# Altium schematic sheet Power.SchDoc
size A3; SheetNumber: 1; SheetTotal: 2
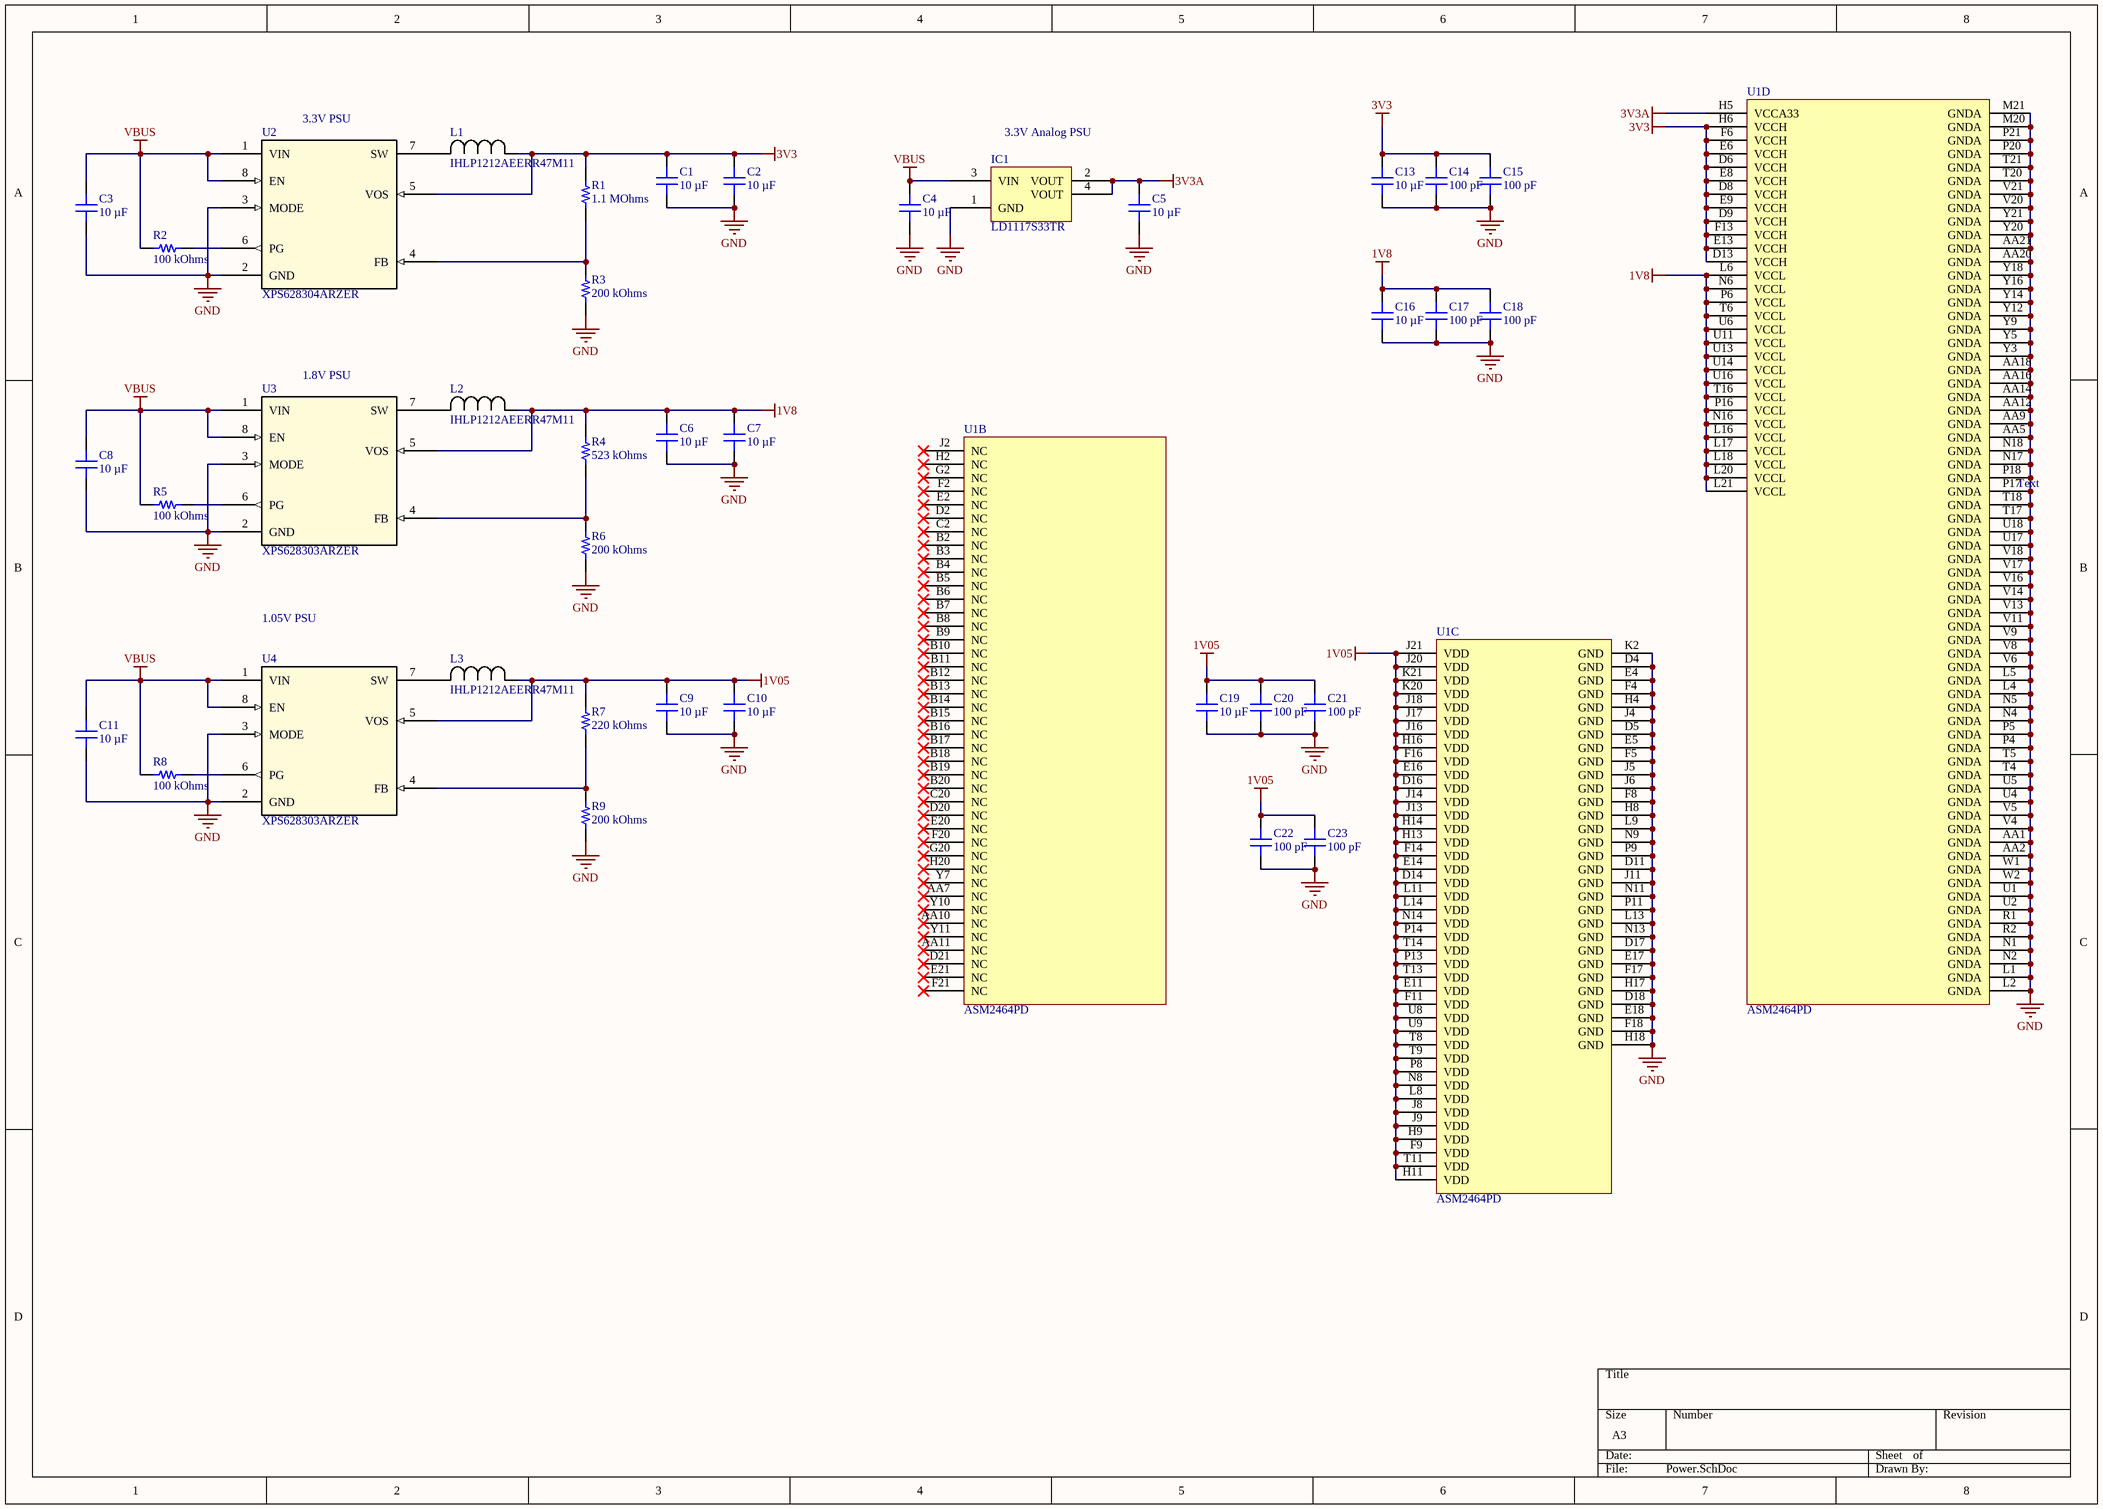
[diagram p0: Power.SchDoc]

## Parts
C1  10 µF  [CAP 0805_2012]
C2  10 µF  [CAP 0805_2012]
C3  10 µF  [CAP 0805_2012]
C4  10 µF  [CAP 0805_2012]
C5  10 µF  [CAP 0805_2012]
C6  10 µF  [CAP 0805_2012]
C7  10 µF  [CAP 0805_2012]
C8  10 µF  [CAP 0805_2012]
C9  10 µF  [CAP 0805_2012]
C10  10 µF  [CAP 0805_2012]
C11  10 µF  [CAP 0805_2012]
C13  10 µF  [CAP 0805_2012]
C14  100 pF  [CAP 0603_1608]
C15  100 pF  [CAP 0603_1608]
C16  10 µF  [CAP 0805_2012]
C17  100 pF  [CAP 0603_1608]
C18  100 pF  [CAP 0603_1608]
C19  10 µF  [CAP 0805_2012]
C20  100 pF  [CAP 0603_1608]
C21  100 pF  [CAP 0603_1608]
C22  100 pF  [CAP 0603_1608]
C23  100 pF  [CAP 0603_1608]
IC1  LD1117S33TR  [ST SOT-223]
L1  IHLP1212AEERR47M11  [IND_IHLP-1212AE_VIS]
L2  IHLP1212AEERR47M11  [IND_IHLP-1212AE_VIS]
L3  IHLP1212AEERR47M11  [IND_IHLP-1212AE_VIS]
R1  1.1 MOhms  [RES 0805_2012]
R2  100 kOhms  [RES 0805_2012]
R3  200 kOhms  [RES 0805_2012]
R4  523 kOhms  [RES 0805_2012]
R5  100 kOhms  [RES 0805_2012]
R6  200 kOhms  [RES 0805_2012]
R7  220 kOhms  [RES 0805_2012]
R8  100 kOhms  [RES 0805_2012]
R9  200 kOhms  [RES 0805_2012]
U1  ASM2464PD  [BGA273C46P21X21_1000X1000X98_2]  (parts B,C,D of 4)
U2  XPS628304ARZER  [WQFN-HR8_RZE_TEX]
U3  XPS628303ARZER  [WQFN-HR8_RZE_TEX]
U4  XPS628303ARZER  [WQFN-HR8_RZE_TEX]

## Nets
1V05: C9.2 C10.2 C19.2 C20.2 C21.2 C22.2 C23.2 L3.1 R7.2 U1.D14(VDD) U1.D16(VDD) U1.E11(VDD) U1.E14(VDD) U1.E16(VDD) U1.F9(VDD) U1.F11(VDD) U1.F14(VDD) U1.F16(VDD) U1.H9(VDD) U1.H11(VDD) U1.H13(VDD) U1.H14(VDD) U1.H16(VDD) U1.J8(VDD) U1.J9(VDD) U1.J13(VDD) U1.J14(VDD) U1.J16(VDD) U1.J17(VDD) U1.J18(VDD) U1.J20(VDD) U1.J21(VDD) U1.K20(VDD) U1.K21(VDD) U1.L8(VDD) U1.L11(VDD) U1.L14(VDD) U1.N8(VDD) U1.N14(VDD) U1.P8(VDD) U1.P13(VDD) U1.P14(VDD) U1.T8(VDD) U1.T9(VDD) U1.T11(VDD) U1.T13(VDD) U1.T14(VDD) U1.U8(VDD) U1.U9(VDD) U4.5(VOS)
1V8: C6.2 C7.2 C16.2 C17.2 C18.2 L2.1 R4.2 U1.L6(VCCL) U1.L16(VCCL) U1.L17(VCCL) U1.L18(VCCL) U1.L20(VCCL) U1.L21(VCCL) U1.N6(VCCL) U1.N16(VCCL) U1.P6(VCCL) U1.P16(VCCL) U1.T6(VCCL) U1.T16(VCCL) U1.U6(VCCL) U1.U11(VCCL) U1.U13(VCCL) U1.U14(VCCL) U1.U16(VCCL) U3.5(VOS)
3V3: C1.2 C2.2 C13.2 C14.2 C15.2 L1.1 R1.2 U1.D6(VCCH) U1.D8(VCCH) U1.D9(VCCH) U1.D13(VCCH) U1.E6(VCCH) U1.E8(VCCH) U1.E9(VCCH) U1.E13(VCCH) U1.F6(VCCH) U1.F13(VCCH) U1.H6(VCCH) U2.5(VOS)
3V3A: C5.2 IC1.2(VOUT) IC1.4(VOUT) U1.H5(VCCA33)
GND: C1.1 C2.1 C3.1 C4.1 C5.1 C6.1 C7.1 C8.1 C9.1 C10.1 C11.1 C13.1 C14.1 C15.1 C16.1 C17.1 C18.1 C19.1 C20.1 C21.1 C22.1 C23.1 IC1.1(GND) R3.1 R6.1 R9.1 U1.AA1(GNDA) U1.AA2(GNDA) U1.AA5(GNDA) U1.AA9(GNDA) U1.AA12(GNDA) U1.AA14(GNDA) U1.AA16(GNDA) U1.AA18(GNDA) U1.AA20(GNDA) U1.AA21(GNDA) U1.D4(GND) U1.D5(GND) U1.D11(GND) U1.D17(GND) U1.D18(GND) U1.E4(GND) U1.E5(GND) U1.E17(GND) U1.E18(GND) U1.F4(GND) U1.F5(GND) U1.F8(GND) U1.F17(GND) U1.F18(GND) U1.H4(GND) U1.H8(GND) U1.H17(GND) U1.H18(GND) U1.J4(GND) U1.J5(GND) U1.J6(GND) U1.J11(GND) U1.K2(GND) U1.L1(GNDA) U1.L2(GNDA) U1.L4(GNDA) U1.L5(GNDA) U1.L9(GND) U1.L13(GND) U1.M20(GNDA) U1.M21(GNDA) U1.N1(GNDA) U1.N2(GNDA) U1.N4(GNDA) U1.N5(GNDA) U1.N9(GND) U1.N11(GND) U1.N13(GND) U1.N17(GNDA) U1.N18(GNDA) U1.P4(GNDA) U1.P5(GNDA) U1.P9(GND) U1.P11(GND) U1.P17(GNDA) U1.P18(GNDA) U1.P20(GNDA) U1.P21(GNDA) U1.R1(GNDA) U1.R2(GNDA) U1.T4(GNDA) U1.T5(GNDA) U1.T17(GNDA) U1.T18(GNDA) U1.T20(GNDA) U1.T21(GNDA) U1.U1(GNDA) U1.U2(GNDA) U1.U4(GNDA) U1.U5(GNDA) U1.U17(GNDA) U1.U18(GNDA) U1.V4(GNDA) U1.V5(GNDA) U1.V6(GNDA) U1.V8(GNDA) U1.V9(GNDA) U1.V11(GNDA) U1.V13(GNDA) U1.V14(GNDA) U1.V16(GNDA) U1.V17(GNDA) U1.V18(GNDA) U1.V20(GNDA) U1.V21(GNDA) U1.W1(GNDA) U1.W2(GNDA) U1.Y3(GNDA) U1.Y5(GNDA) U1.Y9(GNDA) U1.Y12(GNDA) U1.Y14(GNDA) U1.Y16(GNDA) U1.Y18(GNDA) U1.Y20(GNDA) U1.Y21(GNDA) U2.2(GND) U2.3(MODE) U3.2(GND) U3.3(MODE) U4.2(GND) U4.3(MODE)
VBUS: C3.2 C4.2 C8.2 C11.2 IC1.3(VIN) R2.1 R5.1 R8.1 U2.1(VIN) U2.8(EN) U3.1(VIN) U3.8(EN) U4.1(VIN) U4.8(EN)
NetL1_2: L1.2 U2.7(SW)
NetL2_2: L2.2 U3.7(SW)
NetL3_2: L3.2 U4.7(SW)
NetR1_1: R1.1 R3.2 U2.4(FB)
NetR2_2: R2.2 U2.6(PG)
NetR4_1: R4.1 R6.2 U3.4(FB)
NetR5_2: R5.2 U3.6(PG)
NetR7_1: R7.1 R9.2 U4.4(FB)
NetR8_2: R8.2 U4.6(PG)

Not connected (* = marked no-connect by the designer): U1 AA7(NC)* AA10(NC)* AA11(NC)* B2(NC)* B3(NC)* B4(NC)* B5(NC)* B6(NC)* B7(NC)* B8(NC)* B9(NC)* B10(NC)* B11(NC)* B12(NC)* B13(NC)* B14(NC)* B15(NC)* B16(NC)* B17(NC)* B18(NC)* B19(NC)* B20(NC)* C2(NC)* C20(NC)* D2(NC)* D20(NC)* D21(NC)* E2(NC)* E20(NC)* E21(NC)* F2(NC)* F20(NC)* F21(NC)* G2(NC)* G20(NC)* H2(NC)* H20(NC)* J2(NC)* Y7(NC)* Y10(NC)* Y11(NC)*

## Notes on the sheet
- (near U2) 3.3V PSU
- (near IC1) 3.3V Analog PSU
- (near U3) 1.8V PSU
- 1.05V PSU
- (in symbol CMP-015-00009-7, part D) Text

## Library data of the parts
C1-C11 C13 C16 C19 = GRM21BR61C106ME15L: CAP CER 10UF 16V X5R 0805; manufacturer: Murata Electronics; Tolerance: ±20%; Part Number: GRM21BR61C106ME15L; Value: 10 µF; Applications: General Purpose; Capacitance: 10 µF; componentlink1description: Datasheet; componentlink1url: https://search.murata.co.jp/Ceramy/image/img/A01X/G101/ENG/GRM21BR61C106ME15-01.pdf; componentlink2description: DigiKey Link; componentlink2url: https://www.digikey.com/en/products/detail/murata-electronics/GRM21BR61C106ME15L/2546905; Device Package: 0805 (2012 Metric); lastupdated: 9-2-2024 20:15:38; Lifecycle Status: Active; Minimum Order: 1; Mounting Type: Surface Mount, MLCC; Operating Temperature: -55°C ~ 85°C; Package / Case: 0805 (2012 Metric); packaging: TapeAndReel; partid: 14090; Part Status: Active; price: 0.04; series: GRM; Size / Dimension: 0.079" L x 0.049" W (2.00mm x 1.25mm); Supplier 1: DigiKey; Supplier Part Number 1: 490-6474-1-ND; Temperature Coefficient: X5R; Thickness (Max): 0.053" (1.35mm); Voltage - Rated: 16V
C14 C15 C17 C18 C20-C23 = GCM1885G2A101JA16D: CAP CER 100PF 100V X8G 0603; manufacturer: Murata Electronics; Tolerance: ±5%; Part Number: GCM1885G2A101JA16D; Value: 100 pF; Applications: Automotive; Capacitance: 100 pF; componentlink1description: Datasheet; componentlink1url: https://search.murata.co.jp/Ceramy/image/img/A01X/G101/ENG/GCM1885G2A101JA16-01.pdf; componentlink2description: DigiKey Link; componentlink2url: https://www.digikey.com/en/products/detail/murata-electronics/GCM1885G2A101JA16D/13401834; Device Package: 0603 (1608 Metric); lastupdated: 9-2-2024 20:09:40; Lifecycle Status: Active; Minimum Order: 1; Mounting Type: Surface Mount, MLCC; Operating Temperature: -55°C ~ 150°C; Package / Case: 0603 (1608 Metric); packaging: TapeAndReel; partid: 48316; Part Status: Active; price: 0.01; Ratings: AEC-Q200; series: GCM; Size / Dimension: 0.063" L x 0.031" W (1.60mm x 0.80mm); Supplier 1: DigiKey; Supplier Part Number 1: 490-GCM1885G2A101JA16DCT-ND; Temperature Coefficient: X8G; Thickness (Max): 0.035" (0.90mm); Voltage - Rated: 100V
IC1 = LD1117S33TR: IC REG LINEAR 3.3V 800MA SOT223; Manufacturer: STMicroelectronics; Current - Quiescent (Iq): 10 mA; Number of Regulators: 1; Output Configuration: Positive; Output Type: Fixed; Protection Features: Over Current, Over Temperature; PSRR: 75dB (120Hz); Voltage Dropout (Max): 1.2V @ 800mA; Voltage - Input (Max): 15V; Part Number: LD1117S33TR; ComponentLink1Description: Datasheet; ComponentLink1URL: http://www.st.com/content/ccc/resource/technical/document/datasheet/99/3b/7d/91/91/51/4b/be/CD00000544.pdf/files/CD00000544.pdf/jcr:content/translations/en.CD00000544.pdf; ComponentLink2Description: DigiKey Link; ComponentLink2URL: https://www.digikey.com/en/products/detail/stmicroelectronics/LD1117S33TR/585766; Current - Output: 800mA; LastUpdated: 4-2-2024 21:49:54; Lifecycle Status: Active; Minimum Order: 1; Mounting Type: Surface Mount; Operating Temperature: 0°C ~ 125°C; Package / Case: TO-261-4, TO-261AA; Packaging: TapeAndReel; Part Status: Active; Price: 0.21; Series: -; Supplier 1: DigiKey; Supplier Part Number 1: 497-1242-1-ND; Supplier Device Package: SOT-223; Voltage - Output (Min/Fixed): 3.3V
L1-L3 = IHLP1212AEERR47M11: No Description Available; Mfr_Name: Vishay
R1 = ERJ-6GEYJ115V: RES SMD 1.1M OHM 5% 1/8W 0805; Manufacturer: Panasonic Electronic Components; Power (Watts): 0.125W, 1/8W; Temperature Coefficient: -400/ +150ppm/°C; Part Number: ERJ-6GEYJ115V; Value: 1.1 MOhms; ComponentLink1Description: Datasheet; ComponentLink1URL: http://industrial.panasonic.com/www-cgi/jvcr13pz.cgi?E+PZ+3+AOA0001+ERJ6GEYJ115V+7+WW; ComponentLink2Description: DigiKey Link; ComponentLink2URL: https://www.digikey.com/en/products/detail/panasonic-electronic-components/ERJ-6GEYJ115V/83160; Composition: Thick Film; Device Package: 0805 (2012 Metric); Features: Automotive AEC-Q200; Height - Seated (Max): 0.028" (0.70mm); LastUpdated: 8-2-2024 21:02:02; Lifecycle Status: Active; Minimum Order: 1; Number of Terminations: 2; Operating Temperature: -55°C ~ 155°C; Package / Case: 0805 (2012 Metric); Packaging: TapeAndReel; PartId: 36374; Part Status: Active; Price: 0.01; Ratings: AEC-Q200; Resistance: 1.1 MOhms; Series: ERJ-6G; Size / Dimension: 0.079" L x 0.049" W (2.00mm x 1.25mm); Supplier 1: DigiKey; Supplier Part Number 1: P1.1MACT-ND; Supplier Device Package: 0805; Tolerance: ±5%
R2 R5 R8 = CRCW0805100KFKEA: RES SMD 100K OHM 1% 1/8W 0805; Manufacturer: Vishay Dale; Power (Watts): 0.125W, 1/8W; Temperature Coefficient: ±100ppm/°C; Part Number: CRCW0805100KFKEA; Value: 100 kOhms; ComponentLink1Description: Datasheet; ComponentLink1URL: http://www.vishay.com/docs/20035/dcrcwe3.pdf; ComponentLink2Description: DigiKey Link; ComponentLink2URL: https://www.digikey.com/en/products/detail/vishay-dale/CRCW0805100KFKEA/1175865; Composition: Thick Film; Device Package: 0805 (2012 Metric); Features: Automotive AEC-Q200; Height - Seated (Max): 0.020" (0.50mm); LastUpdated: 8-2-2024 21:02:17; Lifecycle Status: Active; Minimum Order: 1; Number of Terminations: 2; Operating Temperature: -55°C ~ 155°C; Package / Case: 0805 (2012 Metric); Packaging: TapeAndReel; PartId: 32640; Part Status: Active; Price: 0.01; Ratings: AEC-Q200; Resistance: 100 kOhms; Series: CRCW; Size / Dimension: 0.079" L x 0.049" W (2.00mm x 1.25mm); Supplier 1: DigiKey; Supplier Part Number 1: 541-100KCCT-ND; Supplier Device Package: 0805; Tolerance: ±1%
R3 R6 R9 = ERJ-6GEYJ204V: RES SMD 200K OHM 5% 1/8W 0805; Manufacturer: Panasonic Electronic Components; Power (Watts): 0.125W, 1/8W; Temperature Coefficient: ±200ppm/°C; Part Number: ERJ-6GEYJ204V; Value: 200 kOhms; ComponentLink1Description: Datasheet; ComponentLink1URL: http://industrial.panasonic.com/www-cgi/jvcr13pz.cgi?E+PZ+3+AOA0001+ERJ6GEYJ204V+7+WW; ComponentLink2Description: DigiKey Link; ComponentLink2URL: https://www.digikey.com/en/products/detail/panasonic-electronic-components/ERJ-6GEYJ204V/83124; Composition: Thick Film; Device Package: 0805 (2012 Metric); Features: Automotive AEC-Q200; Height - Seated (Max): 0.028" (0.70mm); LastUpdated: 8-2-2024 21:02:29; Lifecycle Status: Active; Minimum Order: 1; Number of Terminations: 2; Operating Temperature: -55°C ~ 155°C; Package / Case: 0805 (2012 Metric); Packaging: TapeAndReel; PartId: 30086; Part Status: Active; Price: 0.01; Ratings: AEC-Q200; Resistance: 200 kOhms; Series: ERJ-6G; Size / Dimension: 0.079" L x 0.049" W (2.00mm x 1.25mm); Supplier 1: DigiKey; Supplier Part Number 1: P200KACT-ND; Supplier Device Package: 0805; Tolerance: ±5%
R4 = ERJ-6ENF5233V: RES SMD 523K OHM 1% 1/8W 0805; Manufacturer: Panasonic Electronic Components; Power (Watts): 0.125W, 1/8W; Temperature Coefficient: ±100ppm/°C; Part Number: ERJ-6ENF5233V; Value: 523 kOhms; ComponentLink1Description: Datasheet; ComponentLink1URL: https://industrial.panasonic.com/cdbs/www-data/pdf/RDA0000/AOA0000C304.pdf; ComponentLink2Description: DigiKey Link; ComponentLink2URL: https://www.digikey.com/en/products/detail/panasonic-electronic-components/ERJ-6ENF5233V/112137; Composition: Thick Film; Device Package: 0805 (2012 Metric); Features: Automotive AEC-Q200; Height - Seated (Max): 0.028" (0.70mm); LastUpdated: 8-2-2024 21:01:04; Lifecycle Status: Active; Minimum Order: 1; Number of Terminations: 2; Operating Temperature: -55°C ~ 155°C; Package / Case: 0805 (2012 Metric); Packaging: TapeAndReel; PartId: 47846; Part Status: Active; Price: 0.01; Ratings: AEC-Q200; Resistance: 523 kOhms; Series: ERJ-6EN; Size / Dimension: 0.079" L x 0.049" W (2.00mm x 1.25mm); Supplier 1: DigiKey; Supplier Part Number 1: P523KCCT-ND; Supplier Device Package: 0805; Tolerance: ±1%
R7 = ERJ-6GEYJ224V: RES SMD 220K OHM 5% 1/8W 0805; Manufacturer: Panasonic Electronic Components; Power (Watts): 0.125W, 1/8W; Temperature Coefficient: ±200ppm/°C; Part Number: ERJ-6GEYJ224V; Value: 220 kOhms; ComponentLink1Description: Datasheet; ComponentLink1URL: http://industrial.panasonic.com/www-cgi/jvcr13pz.cgi?E+PZ+3+AOA0001+ERJ6GEYJ224V+7+WW; ComponentLink2Description: DigiKey Link; ComponentLink2URL: https://www.digikey.com/en/products/detail/panasonic-electronic-components/ERJ-6GEYJ224V/83126; Composition: Thick Film; Device Package: 0805 (2012 Metric); Features: Automotive AEC-Q200; Height - Seated (Max): 0.028" (0.70mm); LastUpdated: 8-2-2024 21:02:29; Lifecycle Status: Active; Minimum Order: 1; Number of Terminations: 2; Operating Temperature: -55°C ~ 155°C; Package / Case: 0805 (2012 Metric); Packaging: TapeAndReel; PartId: 30073; Part Status: Active; Price: 0.01; Ratings: AEC-Q200; Resistance: 220 kOhms; Series: ERJ-6G; Size / Dimension: 0.079" L x 0.049" W (2.00mm x 1.25mm); Supplier 1: DigiKey; Supplier Part Number 1: P220KACT-ND; Supplier Device Package: 0805; Tolerance: ±5%
U1 = CMP-015-00009-7: ASM2464PD, is a new generation of USB4 ®/Thunderbolt to PCIe/NVMe Accessory controller based on ASMedia in-house designed PHYs.; Reference: U; Design Item ID: ASM2464PD; Value: ASM2464PD
U2 = XPS628304ARZER: No Description Available; Mfr_Name: Texas Instruments; Type: Power Management; RefDes: RefDes
U3 U4 = XPS628303ARZER: No Description Available; Mfr_Name: Texas Instruments; Type: Power Management; RefDes: RefDes